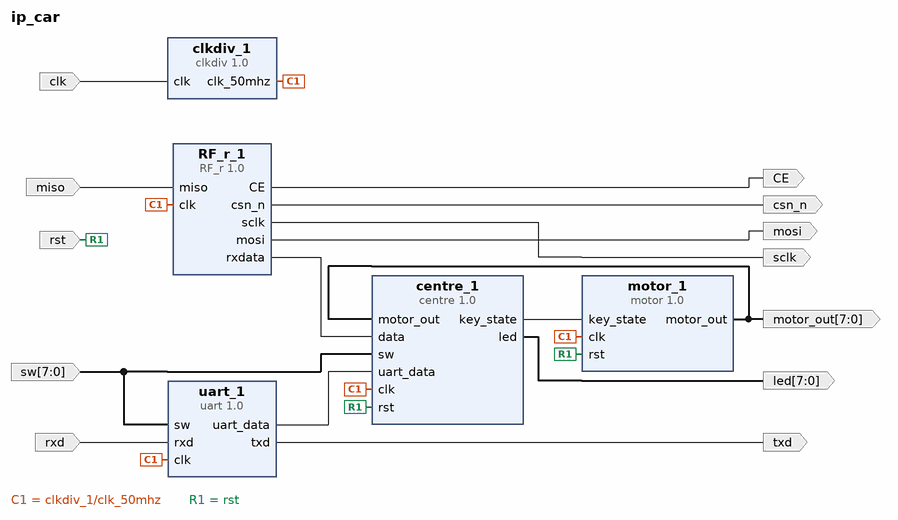
[diagram p0: block diagram of the top level]
# Vivado block design ip_car, Vivado 2013.2
create_bd_design ip_car

create_bd_port -dir I clk
create_bd_port -dir O CE
create_bd_port -dir O csn_n
create_bd_port -dir O sclk
create_bd_port -dir O mosi
create_bd_port -dir O -from 7 -to 0 led
create_bd_port -dir O -from 7 -to 0 motor_out
create_bd_port -dir O txd
create_bd_port -dir I miso
create_bd_port -dir I rxd
create_bd_port -dir I -from 7 -to 0 sw
create_bd_port -dir I rst

create_bd_cell -type ip -vlnv xilinx.com:user:motor:1.0 motor_1
create_bd_cell -type ip -vlnv xilinx.com:ip:clkdiv:1.0 clkdiv_1
create_bd_cell -type ip -vlnv xilinx.com:user:RF_r:1.0 RF_r_1
create_bd_cell -type ip -vlnv xilinx.com:user:uart:1.0 uart_1
create_bd_cell -type ip -vlnv xilinx.com:user:centre:1.0 centre_1

# ---- connections ----

connect_bd_net [get_bd_pins RF_r_1/rxdata] [get_bd_pins centre_1/data]
connect_bd_net [get_bd_ports clk] [get_bd_pins clkdiv_1/clk]
connect_bd_net [get_bd_pins RF_r_1/CE] [get_bd_ports CE]
connect_bd_net [get_bd_pins RF_r_1/csn_n] [get_bd_ports csn_n]
connect_bd_net [get_bd_pins RF_r_1/sclk] [get_bd_ports sclk]
connect_bd_net [get_bd_pins RF_r_1/mosi] [get_bd_ports mosi]
connect_bd_net [get_bd_pins centre_1/led] [get_bd_ports led]
connect_bd_net [get_bd_pins motor_1/motor_out] [get_bd_ports motor_out] [get_bd_pins centre_1/motor_out]
connect_bd_net [get_bd_pins uart_1/txd] [get_bd_ports txd]
connect_bd_net [get_bd_pins clkdiv_1/clk_50mhz] [get_bd_pins RF_r_1/clk] [get_bd_pins centre_1/clk] [get_bd_pins motor_1/clk] [get_bd_pins uart_1/clk]
connect_bd_net [get_bd_ports miso] [get_bd_pins RF_r_1/miso]
connect_bd_net [get_bd_ports rxd] [get_bd_pins uart_1/rxd]
connect_bd_net [get_bd_ports sw] [get_bd_pins uart_1/sw] [get_bd_pins centre_1/sw]
connect_bd_net [get_bd_pins uart_1/uart_data] [get_bd_pins centre_1/uart_data]
connect_bd_net [get_bd_ports rst] [get_bd_pins motor_1/rst] [get_bd_pins centre_1/rst]
connect_bd_net [get_bd_pins centre_1/key_state] [get_bd_pins motor_1/key_state]

validate_bd_design
save_bd_design
